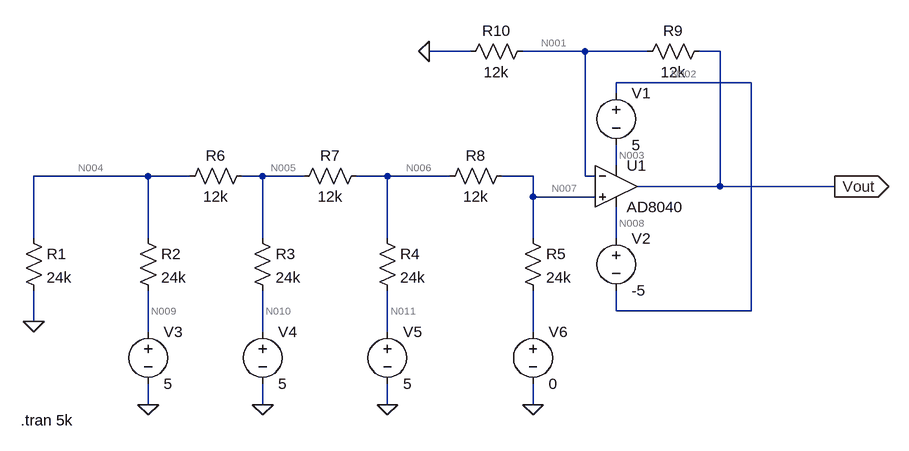
[diagram p0: schematic Draft1.asc]
Draft1.asc, the LTspice schematic file:
Version 4
SHEET 1 1392 680
WIRE 720 -80 656 -80
WIRE 896 -80 800 -80
WIRE 992 -80 896 -80
WIRE 1104 -80 1072 -80
WIRE 1152 -32 944 -32
WIRE 944 -16 944 -32
WIRE 944 96 944 64
WIRE 224 112 48 112
WIRE 288 112 224 112
WIRE 400 112 368 112
WIRE 464 112 400 112
WIRE 592 112 544 112
WIRE 688 112 592 112
WIRE 816 112 768 112
WIRE 896 112 896 -80
WIRE 912 112 896 112
WIRE 1104 128 1104 -80
WIRE 1104 128 976 128
WIRE 1280 128 1104 128
WIRE 816 144 816 112
WIRE 912 144 816 144
WIRE 48 208 48 112
WIRE 224 208 224 112
WIRE 400 208 400 112
WIRE 592 208 592 112
WIRE 816 208 816 144
WIRE 944 208 944 160
WIRE 944 320 944 288
WIRE 1152 320 1152 -32
WIRE 1152 320 944 320
WIRE 48 336 48 288
WIRE 224 352 224 288
WIRE 400 352 400 288
WIRE 592 352 592 288
WIRE 816 352 816 288
WIRE 224 464 224 432
WIRE 400 464 400 432
WIRE 592 464 592 432
WIRE 816 464 816 432
FLAG 656 -80 0
FLAG 48 336 0
FLAG 224 464 0
FLAG 400 464 0
FLAG 592 464 0
FLAG 816 464 0
FLAG 1280 128 Vout
IOPIN 1280 128 Out
SYMBOL res 32 192 R0
SYMATTR InstName R1
SYMATTR Value 24k
SYMBOL res 208 192 R0
SYMATTR InstName R2
SYMATTR Value 24k
SYMBOL res 384 192 R0
SYMATTR InstName R3
SYMATTR Value 24k
SYMBOL res 576 192 R0
SYMATTR InstName R4
SYMATTR Value 24k
SYMBOL res 800 192 R0
SYMATTR InstName R5
SYMATTR Value 24k
SYMBOL res 384 96 R90
WINDOW 0 0 56 VBottom 2
WINDOW 3 32 56 VTop 2
SYMATTR InstName R6
SYMATTR Value 12k
SYMBOL res 560 96 R90
WINDOW 0 0 56 VBottom 2
WINDOW 3 32 56 VTop 2
SYMATTR InstName R7
SYMATTR Value 12k
SYMBOL res 784 96 R90
WINDOW 0 0 56 VBottom 2
WINDOW 3 32 56 VTop 2
SYMATTR InstName R8
SYMATTR Value 12k
SYMBOL res 1088 -96 R90
WINDOW 0 0 56 VBottom 2
WINDOW 3 32 56 VTop 2
SYMATTR InstName R9
SYMATTR Value 12k
SYMBOL res 816 -96 R90
WINDOW 0 0 56 VBottom 2
WINDOW 3 32 56 VTop 2
SYMATTR InstName R10
SYMATTR Value 12k
SYMBOL voltage 944 -32 R0
WINDOW 123 0 0 Left 0
WINDOW 39 0 0 Left 0
SYMATTR InstName V1
SYMATTR Value 5
SYMBOL voltage 944 192 R0
SYMATTR InstName V2
SYMATTR Value -5
SYMBOL voltage 224 336 R0
WINDOW 123 0 0 Left 0
WINDOW 39 0 0 Left 0
SYMATTR InstName V3
SYMATTR Value 5
SYMBOL voltage 400 336 R0
WINDOW 123 0 0 Left 0
WINDOW 39 0 0 Left 0
SYMATTR InstName V4
SYMATTR Value 5
SYMBOL voltage 592 336 R0
WINDOW 123 0 0 Left 0
WINDOW 39 0 0 Left 0
SYMATTR InstName V5
SYMATTR Value 5
SYMBOL voltage 816 336 R0
WINDOW 123 0 0 Left 0
WINDOW 39 0 0 Left 0
SYMATTR InstName V6
SYMATTR Value 0
SYMBOL Opamps\\AD8040 944 64 R0
SYMATTR InstName U1
TEXT 28 488 Left 2 !.tran 5k

The netlist it stands for:
* Draft1.asc
R1 N004 0 24k
R2 N004 N009 24k
R3 N005 N010 24k
R4 N006 N011 24k
R5 N007 N012 24k
R6 N005 N004 12k
R7 N006 N005 12k
R8 N007 N006 12k
R9 Vout N001 12k
R10 N001 0 12k
V1 N002 N003 5
V2 N008 N002 -5
V3 N009 0 5
V4 N010 0 5
V5 N011 0 5
V6 N012 0 0
XU1 N007 N001 N003 N008 Vout AD8040  ; pins In+ In- V+ V- OUT
.tran 5k
.backanno
.end

* Results of the author's LTspice run, read from the files saved beside the schematic
* Operating Point, zero values left out:
*   V(n004) = 2.947 V
*   V(n009) = 5 V
*   V(n005) = 3.393 V
*   V(n010) = 5 V
*   V(n006) = 3.037 V
*   V(n011) = 5 V
*   V(n007) = 1.698 V
*   V(vout) = 508.4 mV
*   V(n001) = 489.3 mV
*   V(n002) = 5.508 V
*   V(n003) = 508.5 mV
*   V(n008) = 508.5 mV
*   I(R10) = 40.77 µA
*   I(R9) = 1.595 µA
*   I(R8) = -111.5 µA
*   I(R7) = -29.72 µA
*   I(R6) = 37.22 µA
*   I(R5) = 70.76 µA
*   I(R4) = -81.81 µA
*   I(R3) = -66.95 µA
*   I(R2) = -85.56 µA
*   I(R1) = 122.8 µA
*   I(V6) = 70.76 µA
*   I(V5) = -81.81 µA
*   I(V4) = -66.95 µA
*   I(V3) = -85.56 µA
*   I(V2) = -10 A
*   I(V1) = -10 A
*   Ix(u1:1) = 40.77 µA
*   Ix(u1:2) = -39.18 µA
*   Ix(u1:3) = -10 A
*   Ix(u1:4) = 10 A
*   Ix(u1:5) = -1.595 µA